# EAGLE design Interface (EAGLE 7.2.0)
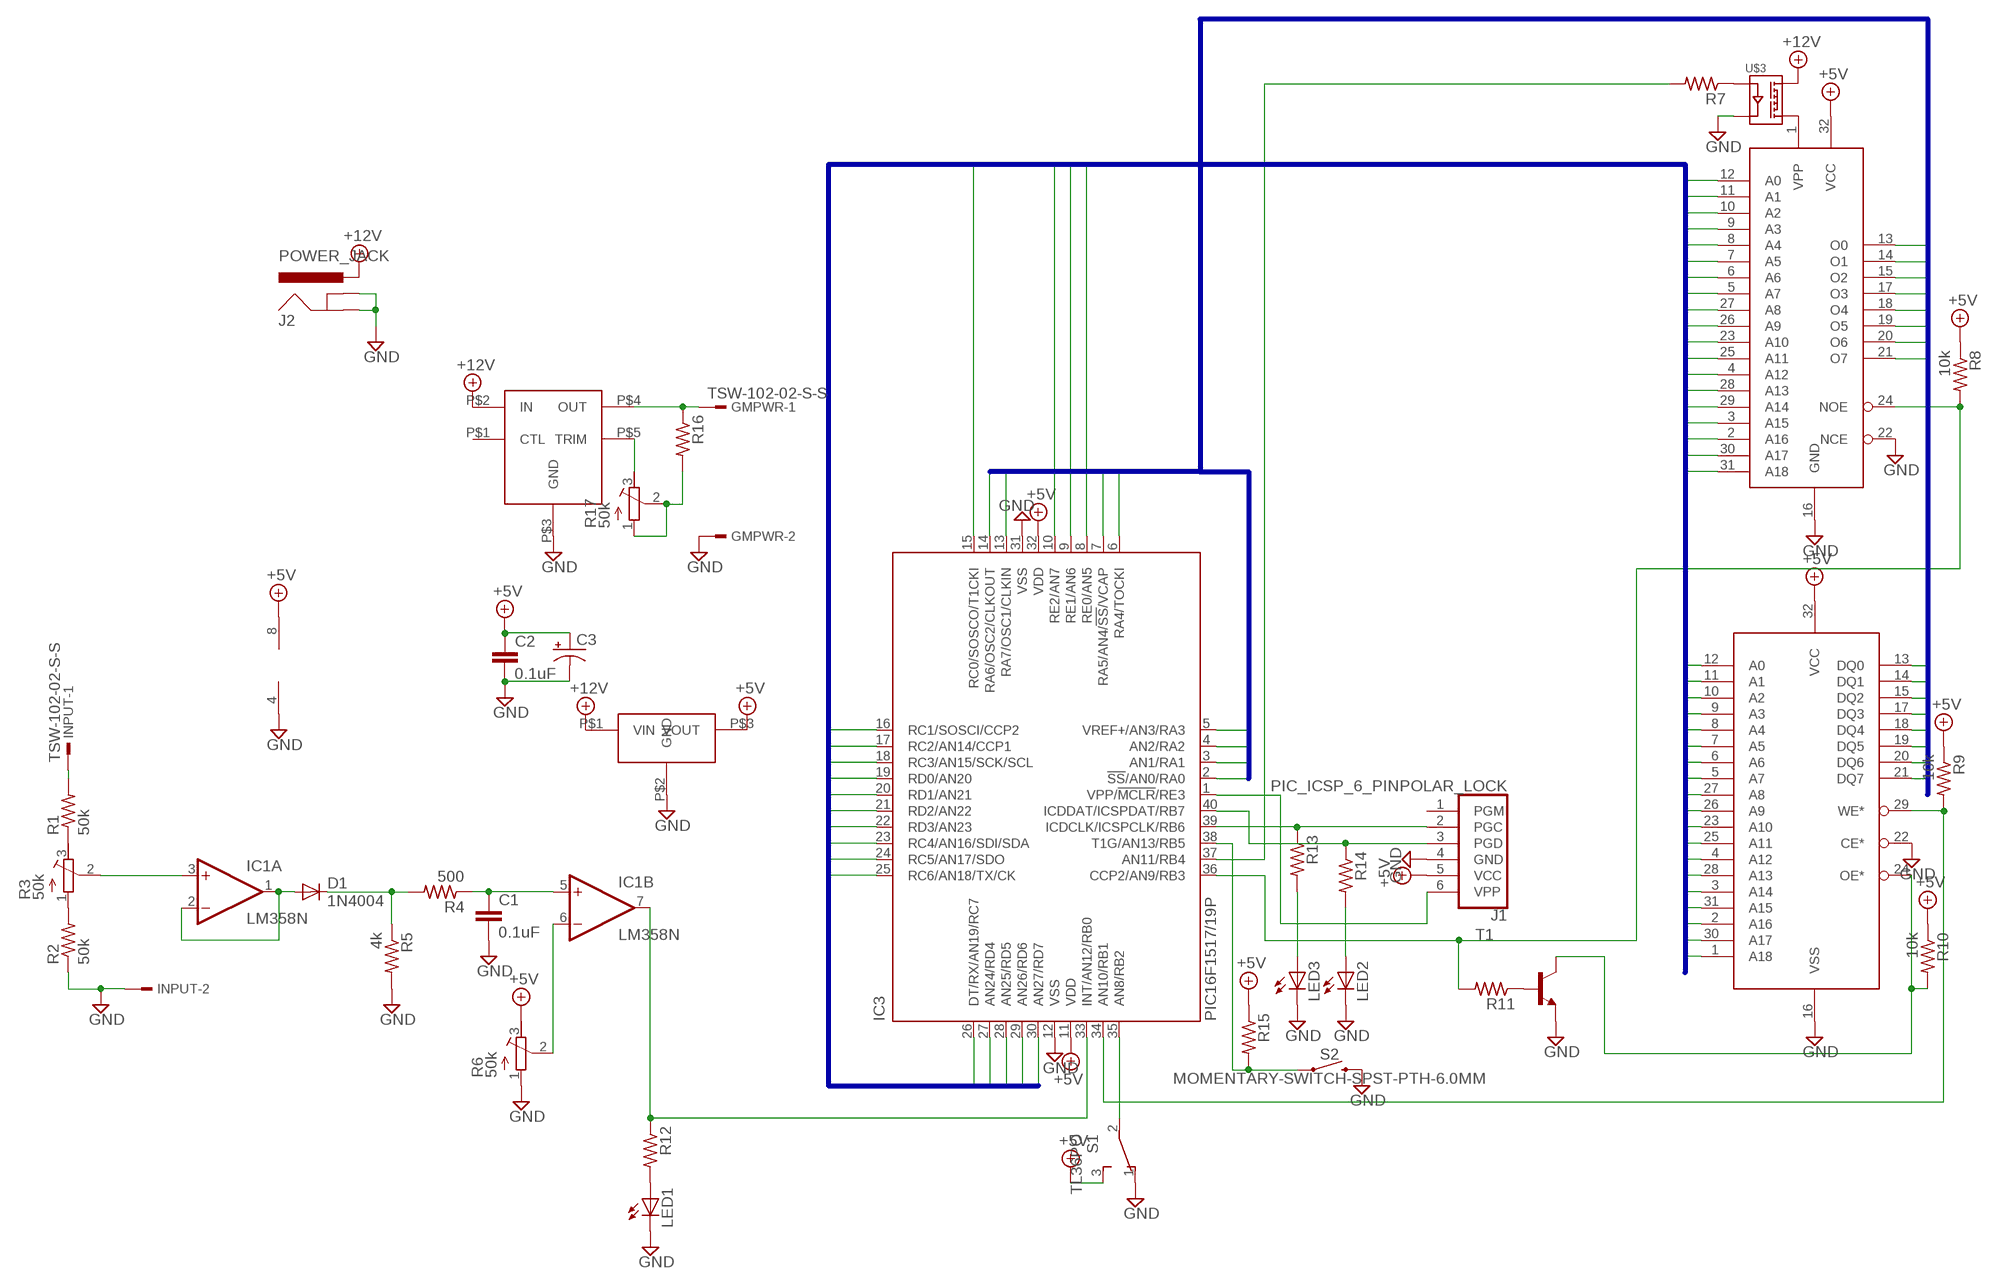
[diagram p0: schematic, sheet 1]

## Parts
C1  0.1uF  C-EU050-025X075  [C050-025X075]
C2  0.1uF  C-EU050-025X075  [C050-025X075]
C3  CPOL-USE5-8.5  [E5-8,5]
D1  1N4004  [DO41-10]
GMPWR  TSW-102-02-S-S  [TSW-102-02-S-S]
IC1  LM358N  [DIL08]
IC3  PIC16F1517/19P  [DIL40]
INPUT  TSW-102-02-S-S  [TSW-102-02-S-S]
J1  PIC_ICSP_6_PINPOLAR_LOCK  [MOLEX-1X6_LOCK]
J2  POWER_JACK  [POWER_JACK_PTH]
LED1  LED3MM  [LED3MM]
LED2  LED3MM  [LED3MM]
LED3  LED3MM  [LED3MM]
R1  50k  R-US_0204/2V  [0204V]
R2  50k  R-US_0204/2V  [0204V]
R3  50k  R-TRIMM3296W  [RTRIM3296W]
R4  500  R-US_0204/2V  [0204V]
R5  4k  R-US_0204/2V  [0204V]
R6  50k  R-TRIMM3296W  [RTRIM3296W]
R7  R-US_0204/2V  [0204V]
R8  10k  R-US_0204/2V  [0204V]
R9  10k  R-US_0204/2V  [0204V]
R10  10k  R-US_0204/2V  [0204V]
R11  R-US_0204/2V  [0204V]
R12  R-US_0204/2V  [0204V]
R13  R-US_0204/2V  [0204V]
R14  R-US_0204/2V  [0204V]
R15  R-US_0204/2V  [0204V]
R16  R-US_0204/2V  [0204V]
R17  50k  R-TRIMM3296W  [RTRIM3296W]
S1  TL36PO  [TL3XPO]
S2  MOMENTARY-SWITCH-SPST-PTH-6.0MM  [TACTILE_SWITCH_PTH_6.0MM]
T1  MPS2222A-NPN-TO92-CBE  [TO92-CBE]
U$1  AT27C040  [DIL32]
U$2  AS6C4008  [DIL32]
U$3  CPC1008N  [SOP04]
U$4  OKR-T/1.5-W12-C  OKR-T  [SIP5]
U$5  OKI-78SR-5/1.5-W36-C  [SIP_PS]

## Nets
+5V: C2.1 C3.+ IC1.8(P:V+) IC3.11(VDD) IC3.32(VDD) J1.5(VCC) R6.3(E) R8.1 R9.1 R10.1 R15.1 S1.3(S) U$1.32(VCC) U$2.32(VCC) U$5.P$3(VOUT)
+12V: J2.PWR U$3.4(DC) U$4.P$2(IN) U$5.P$1(VIN)
A0: IC3.15(RC0/SOSCO/T1CKI) U$1.12(A0) U$2.12(A0)
A1: IC3.16(RC1/SOSCI/CCP2) U$1.11(A1) U$2.11(A1)
A2: IC3.17(RC2/AN14/CCP1) U$1.10(A2) U$2.10(A2)
A3: IC3.18(RC3/AN15/SCK/SCL) U$1.9(A3) U$2.9(A3)
A4: IC3.23(RC4/AN16/SDI/SDA) U$1.8(A4) U$2.8(A4)
A5: IC3.24(RC5/AN17/SDO) U$1.7(A5) U$2.7(A5)
A6: IC3.25(RC6/AN18/TX/CK) U$1.6(A6) U$2.6(A6)
A7: IC3.26(DT/RX/AN19/RC7) U$1.5(A7) U$2.5(A7)
A8: IC3.19(RD0/AN20) U$1.27(A8) U$2.27(A8)
A9: IC3.20(RD1/AN21) U$1.26(A9) U$2.26(A9)
A10: IC3.21(RD2/AN22) U$1.23(A10) U$2.23(A10)
A11: IC3.22(RD3/AN23) U$1.25(A11) U$2.25(A11)
A12: IC3.27(AN24/RD4) U$1.4(A12) U$2.4(A12)
A13: IC3.28(AN25/RD5) U$1.28(A13) U$2.28(A13)
A14: IC3.29(AN26/RD6) U$1.29(A14) U$2.3(A14)
A15: IC3.30(AN27/RD7) U$1.3(A15) U$2.31(A15)
A16: IC3.8(RE0/AN5) U$1.2(A16) U$2.2(A16)
A17: IC3.9(RE1/AN6) U$1.30(A17) U$2.30(A17)
A18: IC3.10(RE2/AN7) U$1.31(A18) U$2.1(A18)
D0: IC3.2(!SS!/AN0/RA0) U$1.13(O0) U$2.13(DQ0)
D1: IC3.3(AN1/RA1) U$1.14(O1) U$2.14(DQ1)
D2: IC3.4(AN2/RA2) U$1.15(O2) U$2.15(DQ2)
D3: IC3.5(VREF+/AN3/RA3) U$1.17(O3) U$2.17(DQ3)
D4: IC3.6(RA4/TOCKI) U$1.18(O4) U$2.18(DQ4)
D5: IC3.7(RA5/AN4/!SS!/VCAP) U$1.19(O5) U$2.19(DQ5)
D6: IC3.14(RA6/OSC2/CLKOUT) U$1.20(O6) U$2.20(DQ6)
D7: IC3.13(RA7/OSC1/CLKIN) U$1.21(O7) U$2.21(DQ7)
GND: C1.2 C2.2 C3.- GMPWR.2 IC1.4(P:V-) IC3.12(VSS) IC3.31(VSS) INPUT.2 J1.4(GND) J2.GND J2.GNDBREAK LED1.K(C) LED2.K(C) LED3.K(C) R2.1 R5.2 R6.1(A) S1.1(O) S2.3 T1.E U$1.16(GND) U$1.22(NCE) U$2.16(VSS) U$2.22(CE*) U$3.3(IN-) U$4.P$3(GND) U$5.P$2(GND)
N$1: R1.1 R3.3(E)
N$2: R2.2 R3.1(A)
N$3: IC1.6(B:-IN) R6.2(S)
N$4: INPUT.1 R1.2
N$5: D1.A IC1.1(A:OUT) IC1.2(A:-IN)
N$6: IC1.3(A:+IN) R3.2(S)
N$7: D1.C R4.2 R5.1
N$8: C1.1 IC1.5(B:+IN) R4.1
N$9: IC3.39(ICDCLK/ICSPCLK/RB6) J1.2(PGC) R13.1
N$10: IC3.40(ICDDAT/ICSPDAT/RB7) J1.3(PGD) R14.1
N$11: IC3.34(AN10/RB1) R9.2 U$2.29(WE*)
N$12: R11.1 T1.B
N$13: IC3.36(CCP2/AN9/RB3) R8.2 R11.2 U$1.24(NOE)
N$14: IC1.7(B:OUT) IC3.33(INT/AN12/RB0) R12.1
N$15: IC3.1(VPP/!MCLR!/RE3) J1.6(VPP)
N$16: U$1.1(VPP) U$3.6(DC)
N$17: R7.1 U$3.1(IN+)
N$18: IC3.37(AN11/RB4) R7.2
N$19: R10.2 T1.C U$2.24(OE*)
N$20: LED1.A R12.2
N$21: IC3.35(AN8/RB2) S1.2(P)
N$22: LED2.A R14.2
N$23: LED3.A R13.2
N$24: IC3.38(T1G/AN13/RB5) R15.2 S2.1
N$25: GMPWR.1 R16.1 U$4.P$4(OUT)
N$26: R17.3(E) U$4.P$5(TRIM)
N$27: R16.2 R17.1(A) R17.2(S)
Unconnected: J1.1(PGM) U$4.P$1(CTL)

## Buses
A0,A1,A2,A3,A4,A5,A6,A7,A8,A9,A10,A11,A12,A13,A14,A15,A16,A17,A18
D0,D1,D2,D3,D4,D5,D6,D7

## Library data of the parts
C1 C2 = resistor:C-EU: CAPACITOR, European symbol
C3 = resistor:CPOL-US: POLARIZED CAPACITOR, American symbol
D1 = diode:1N4004: DIODE general purpose rectifier, 1 A
GMPWR INPUT = con-samtec:TSW-102-02-S-S: THROUGH-HOLE .025" SQ POST HEADER Source: Samtec TSW.pdf; OC_FARNELL: unknown; OC_NEWARK: unknown
IC1 = linear:LM358: OP AMP also LM158; LM258; LM2904 Source: http://cache.national.com/ds/LM/LM158.pdf
IC3 = microchip:PIC16*F1517/19: 28/40/44-Pin Flash Microcontrollers with nanoWatt XLP Technology PIC16F1517/1519 AND PIC16LF1517/1519 Source: www.microchip.com PIC16F1516.pdf
J1 = SparkFun-Connectors:PIC_ICSP_6_PIN: ISCP Programming connector for PICs This 6 pin header contains all the lines necessary for programming most PIC microcontrollers. Here is the connector we sell at SparkFun: Polarized Connectors - Header (6-Pin) <https://www.sparkfun.com/products/8094> (PRT-08094) It is used on this SparkFun product: SparkFun UDB5 - PIC UAV Development Board <https://www.sparkfun.com/products/11703> (DEV-11703) Also, if you need a nice PIC programmer, please check these out: MPLAB PICkit 3 <https://www.sparkfun.com/products/9973> (PGM-09973)
J2 = SparkFun-Connectors:POWER_JACK: Power Jack Connector This is the standard 5.5mm barrel jack for power. The PTH is the most common, proven, reliable, footprint. The Slot footprint only works if the mill layer is transmitted to the PCB fab house so be warned. Here are the connectors we sell at SparkFun: DC Barrel Power Jack/Connector <https://www.sparkfun.com/products/119> (PRT-00119) DC Barrel Power Jack/Connector (SMD) <https://www.sparkfun.com/products/12748> (PRT-12748) DC Barrel Jack Adapter - Breadboard Compatible <https://www.sparkfun.com/products/10811> (PRT-10811) It is used on this SparkFun product (and many, many others): SparkFun RedBoard - Programmed with Arduino <https://www.sparkfun.com/products/12757> (DEV-12757) Also, if you need a mating power supply or connector, please check these out: Wall Adapter Power Supply - 9VDC 650mA <https://www.sparkfun.com/products/298> (TOL-00298) DC Barrel Jack Adapter - Male <https://www.sparkfun.com/products/10287> (PRT-10287); PROD_ID: CONN-08197
LED1-LED3 = led:LED: LED OSRAM: - CHIPLED LG R971, LG N971, LY N971, LG Q971, LY Q971, LO R971, LY R971 LH N974, LH R974 LS Q976, LO Q976, LY Q976 LO Q996 - Hyper CHIPLED LW Q18S LB Q993, LB Q99A, LB R99A - SideLED LS A670, LO A670, LY A670, LG A670, LP A670 LB A673, LV A673, LT A673, LW A673 LH A674 LY A675 LS A676, LA A676, LO A676, LY A676, LW A676 LS A679, LY A679, LG A679 - Hyper Micro SIDELED® LS Y876, LA Y876, LO Y876, LY Y876 LT Y87S - SmartLED LW L88C, LW L88S LB L89C, LB L89S, LG L890 LS L89K, LO L89K, LY L89K LS L896, LA L896, LO L896, LY L896 - TOPLED LS T670, LO T670, LY T670, LG T670, LP T670 LSG T670, LSP T670, LSY T670, LOP T670, LYG T670 LG T671, LOG T671, LSG T671 LB T673, LV T673, LT T673, LW T673 LH T674 LS T676, LA T676, LO T676, LY T676, LB T676, LH T676, LSB T676, LW T676 LB T67C, LV T67C, LT T67C, LS T67K, LO T67K, LY T67K, LW E67C LS E67B, LA E67B, LO E67B, LY E67B, LB E67C, LV E67C, LT E67C LW T67C LS T679, LY T679, LG T679 LS T770, LO T770, LY T770, LG T770, LP T770 LB T773, LV T773, LT T773, LW T773 LH T774 LS E675, LA E675, LY E675, LS T675 LS T776, LA T776, LO T776, LY T776, LB T776 LHGB T686 LT T68C, LB T68C - Hyper Mini TOPLED® LB M676 - Mini TOPLED Santana® LG M470 LS M47K, LO M47K, LY M47K Source: http://www.osram.convergy.de LUXEON: - LUMILED® LXK2-PW12-R00, LXK2-PW12-S00, LXK2-PW14-U00, LXK2-PW14-V00 LXK2-PM12-R00, LXK2-PM12-S00, LXK2-PM14-U00 LXK2-PE12-Q00, LXK2-PE12-R00, LXK2-PE12-S00, LXK2-PE14-T00, LXK2-PE14-U00 LXK2-PB12-K00, LXK2-PB12-L00, LXK2-PB12-M00, LXK2-PB14-N00, LXK2-PB14-P00, LXK2-PB14-Q00 LXK2-PR12-L00, LXK2-PR12-M00, LXK2-PR14-Q00, LXK2-PR14-R00 LXK2-PD12-Q00, LXK2-PD12-R00, LXK2-PD12-S00 LXK2-PH12-R00, LXK2-PH12-S00 LXK2-PL12-P00, LXK2-PL12-Q00, LXK2-PL12-R00 Source: www.luxeon.com KINGBRIGHT: KA-3528ASYC Source: www.kingbright.com
R1 R2 R4 R5 R7-R16 = resistor:R-US_: RESISTOR, American symbol
R3 R6 R17 = resistor:R-TRIMM: Trimm resistor
S1 = switch:TL36PO: TINY SWITCH ON - ON Source: http://www2.produktinfo.conrad.com/datenblaetter/700000-724999/705152-da-01-de-Subminiaturschalter_TL_36YO.pdf
S2 = SparkFun-Switches:MOMENTARY-SWITCH-SPST: Momentary Switch (Pushbutton) - SPST Normally-open (NO) SPST momentary switches (buttons, pushbuttons). Variants PTH-12MM - 12mm square, through-hole Momentary Pushbutton Switch - 12mm Square <https://www.sparkfun.com/products/9190> (COM-09190) PTH-6.0MM, PTH-6.0MM-KIT - 6.0mm square, through-hole Mini Pushbutton Switch <https://www.sparkfun.com/products/97> (COM-00097) KIT package intended for soldering kit's - only one side of pads' copper is exposed. PTH-RIGHT-ANGLE-KIT - Right-angle, through-hole Right Angle Tactile Button <https://www.sparkfun.com/products/10791> - Used on SparkFun BigTime Watch Kit <https://www.sparkfun.com/products/11734> SMD-12MM - 12mm square, surface-mount Tactile Button - SMD (12mm) <https://www.sparkfun.com/products/12993> (COM-12993) Used on SparkFun PicoBoard <https://www.sparkfun.com/products/11888> SMD-4.5MM - 4.5mm Square Trackball Switch Used on SparkFun Blackberry Trackballer Breakout <https://www.sparkfun.com/products/13169> SMD-4.6MMX2.8MM - 4.60mm x 2.80mm, surface mount Used on SparkFun SAMD21 Mini Breakout <https://www.sparkfun.com/products/13664> SMD-5.2MM, SMD-5.2-REDUNDANT - 5.2mm square, surface-mount Mini Pushbutton Switch - SMD <https://www.sparkfun.com/products/8720> (COM-08720) Used on Arduino Pro Mini <https://www.sparkfun.com/products/11114> REDUNDANT package connects both switch circuits together SMD-6.0X3.5MM - 6.0 x 3.5mm, surface mount Momentary Reset Switch SMD <https://www.sparkfun.com/products/8229> (COM-08229) SMD-6.2MM-TALL - 6.2mm square, surface mount Tactile Button - SMD (6mm) <https://www.sparkfun.com/products/12992> Used on SparkFun Digital Sandbox <https://www.sparkfun.com/products/12651> SMD-RIGHT-ANGLE - Right-angle, surface mount Used on SparkFun Block for Intel® Edison - Arduino <https://www.sparkfun.com/products/13036>; PROD_ID: SWCH-08441; SF_SKU: COM-00097
T1 = transistor:*-NPN-: NPN Transistror BF959 corrected 2008.03.06
U$1 = Football:AT27C040
U$2 = Football:AS6C4008
U$3 = JSB2:CPC1008N
U$4 = Football:OKR-T
U$5 = JSB2:OKI-78SR-5/1.5-W36-C

## Board
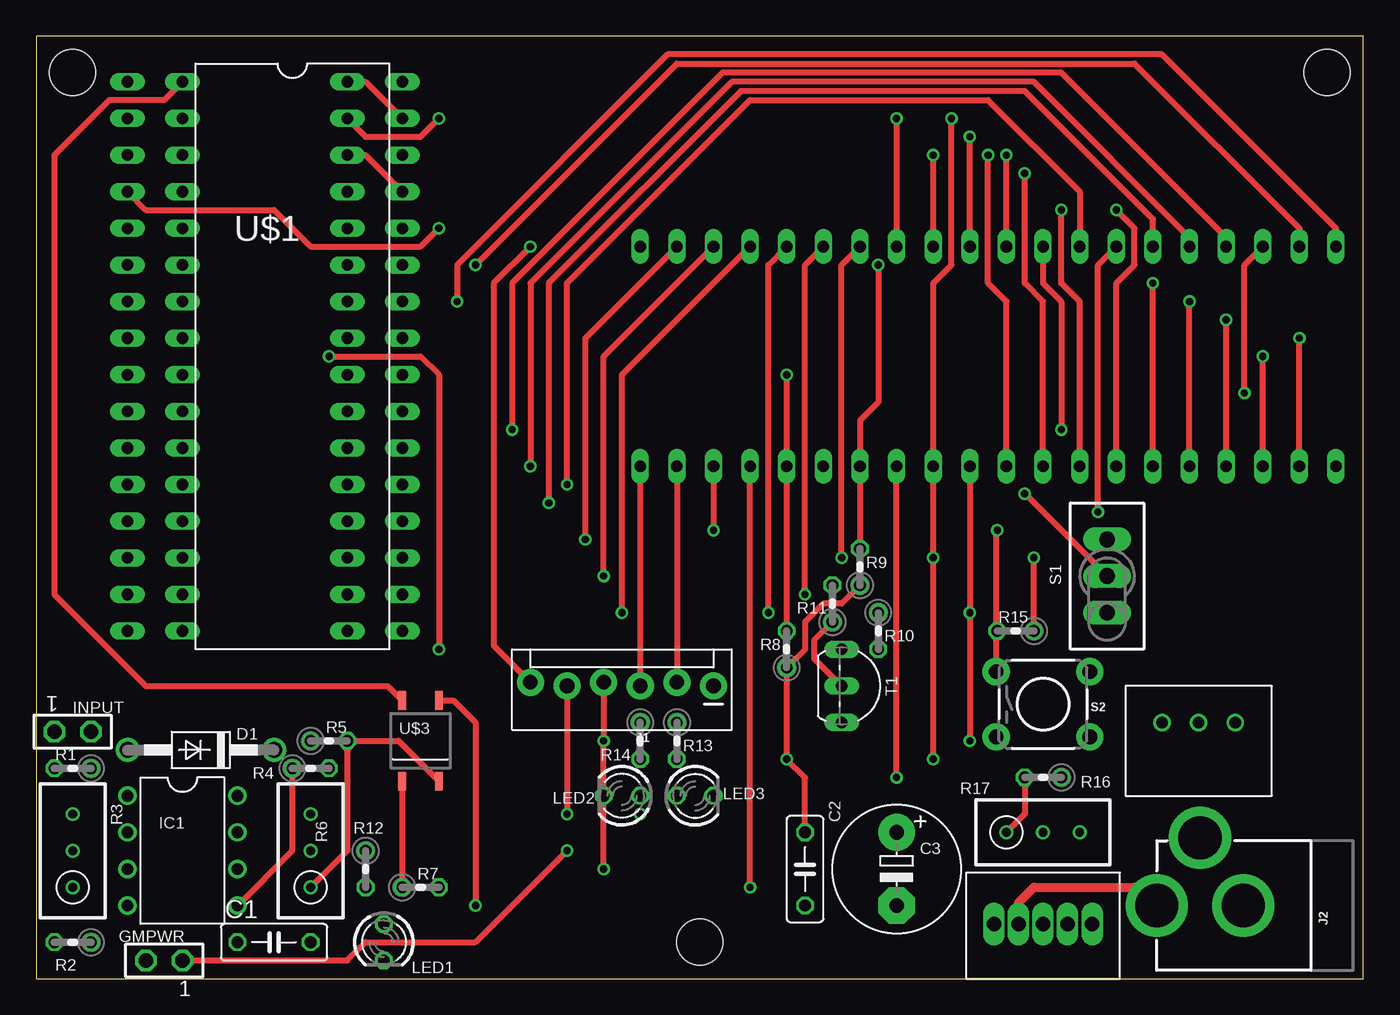
[diagram p1: board, top side]
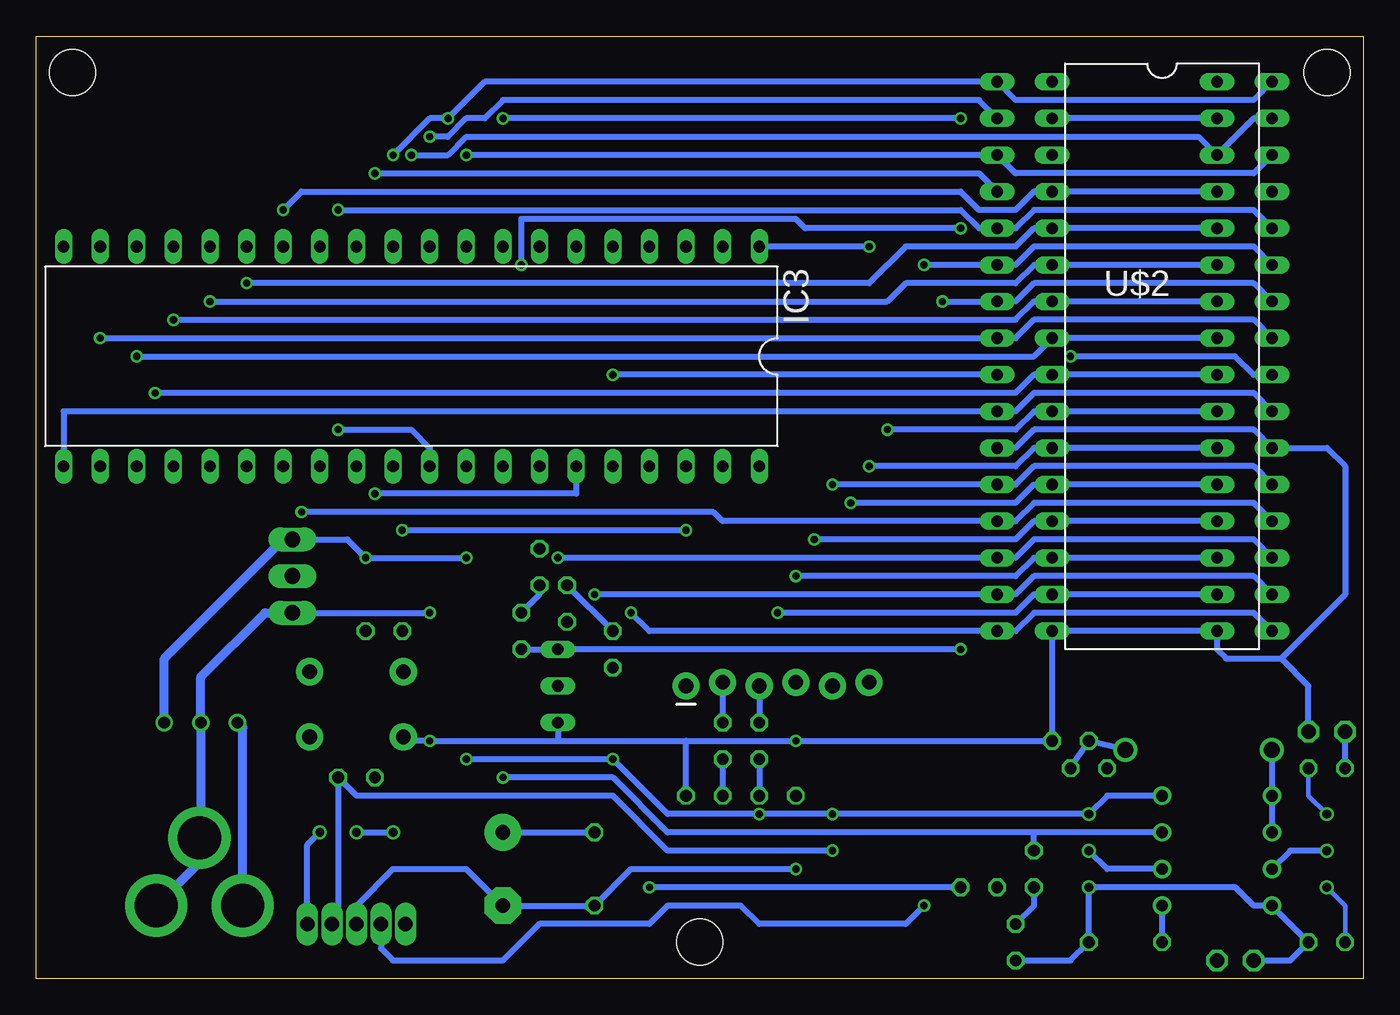
[diagram p2: board, bottom side, seen from below]

Size 92.08 x 65.41 mm. Coordinates in mm from the lower left corner, seen from the top.
Outline: 0,0 92.08,0 92.08,65.41 0,65.41 0,0
Copper layers (1*16): Top 0.0356mm / dielectric 1.5011mm / Bottom 0.0356mm
Design rules "Oshpark": minimum track width 6mil, minimum drill 13mil, track to track 6mil, track to pad 6mil, pad to pad 6mil, via to via 6mil, smd to smd 6mil, copper to edge 15mil, drill to drill 6mil, minimum pad ring 7mil, minimum via ring 7mil, stop-mask expansion 3mil, vias tented up to drill 0mil, thermal gap 10mil
Holes 3.2 mm at 46.04,2.54 89.53,62.87 2.54,62.87

### Footprints (pad centres in the part's own frame; a part is rotated, then mirrored left to right if it is on the bottom)
C050-025X075 = drill 0.813 octagon: 1 -2.54,0; 2 2.54,0
E5-8,5 = drill 1.016 pad 2.54: + -2.54,0 | drill 1.016 pad 2.54 octagon: - 2.54,0
DO41-10 = drill 1.118: A 5.08,0; C -5.08,0
TSW-102-02-S-S = drill 1 pad 1.5 octagon: 1 1.27,0; 2 -1.27,0
DIL08 = drill 0.813 pad 1.27: 1 -3.81,-3.81; 2 -1.27,-3.81; 3 1.27,-3.81; 4 3.81,-3.81; 5 3.81,3.81; 6 1.27,3.81; 7 -1.27,3.81; 8 -3.81,3.81
DIL40 = drill 0.813 long: 1 -24.13,-7.62; 2 -21.59,-7.62; 3 -19.05,-7.62; 4 -16.51,-7.62; 5 -13.97,-7.62; 6 -11.43,-7.62; 7 -8.89,-7.62; 8 -6.35,-7.62; 9 -3.81,-7.62; 10 -1.27,-7.62; 11 1.27,-7.62; 12 3.81,-7.62; 13 6.35,-7.62; 14 8.89,-7.62; 15 11.43,-7.62; 16 13.97,-7.62; 17 16.51,-7.62; 18 19.05,-7.62; 19 21.59,-7.62; 20 24.13,-7.62; 21 24.13,7.62; 22 21.59,7.62; 23 19.05,7.62; 24 16.51,7.62; 25 13.97,7.62; 26 11.43,7.62; 27 8.89,7.62; 28 6.35,7.62; 29 3.81,7.62; 30 1.27,7.62; 31 -1.27,7.62; 32 -3.81,7.62; 33 -6.35,7.62; 34 -8.89,7.62; 35 -11.43,7.62; 36 -13.97,7.62; 37 -16.51,7.62; 38 -19.05,7.62; 39 -21.59,7.62; 40 -24.13,7.62
MOLEX-1X6_LOCK = drill 1.016 pad 1.88: 1 0,0; 2 2.54,-0.254; 3 5.08,0; 4 7.62,-0.254; 5 10.16,0; 6 12.7,-0.254
POWER_JACK_PTH = drill 2.997 pad 4.318: GND 0,7.7; GNDBREAK 4.7,10.7; PWR 0,13.7
LED3MM = drill 0.813 octagon: A -1.27,0; K 1.27,0
0204V = drill 0.813 octagon: 1 -1.27,0; 2 1.27,0
RTRIM3296W = drill 0.61: 1 0,-2.54; 2 0,0; 3 0,2.54
TL3XPO = drill 1.1 pad 1.422 long: 1 -2.54,0; 2 0,0; 3 2.54,0
TACTILE_SWITCH_PTH_6.0MM = drill 1.016 pad 1.88: 1 -3.251,2.261; 2 3.251,2.261; 3 -3.251,-2.261; 4 3.251,-2.261
TO92-CBE = drill 0.813 long: B 0,0; C -2.54,0; E 2.54,0
DIL32 = drill 0.813 long: 1 -19.05,-7.62; 2 -16.51,-7.62; 3 -13.97,-7.62; 4 -11.43,-7.62; 5 -8.89,-7.62; 6 -6.35,-7.62; 7 -3.81,-7.62; 8 -1.27,-7.62; 9 1.27,-7.62; 10 3.81,-7.62; 11 6.35,-7.62; 12 8.89,-7.62; 13 11.43,-7.62; 14 13.97,-7.62; 15 16.51,-7.62; 16 19.05,-7.62; 17 19.05,7.62; 18 16.51,7.62; 19 13.97,7.62; 20 11.43,7.62; 21 8.89,7.62; 22 6.35,7.62; 23 3.81,7.62; 24 1.27,7.62; 25 -1.27,7.62; 26 -3.81,7.62; 27 -6.35,7.62; 28 -8.89,7.62; 29 -11.43,7.62; 30 -13.97,7.62; 31 -16.51,7.62; 32 -19.05,7.62
SOP04 = smd 0.551 x 1.3: 1 -1.27,-2.8; 3 1.27,-2.8; 4 1.27,2.8; 6 -1.27,2.8
SIP5 = drill 1 long: P$1 -3.404,0; P$2 -1.702,0; P$3 0,0; P$4 1.702,0; P$5 3.404,0
SIP_PS = drill 0.8: P$1 -2.54,0; P$2 0,0; P$3 2.54,0

### Placement (x,y rotation side)
C1  16.51,2.54 0 top
C2  53.34,7.62 270 top
C3  59.69,7.62 270 top
D1  11.43,15.88 180 top
GMPWR  8.89,1.27 0 top
IC1  10.16,8.89 270 top
IC3  66.04,43.18 180 bottom
INPUT  2.54,17.14 180 top
J1  46.99,20.32 180 top
J2  91.44,5.08 90 top
LED1  24.13,2.54 270 top
LED2  40.64,12.7 180 top
LED3  45.72,12.7 0 top
R1  2.54,14.61 180 top
R2  2.54,2.54 180 top
R3  2.54,8.89 0 top
R4  19.05,14.61 0 top
R5  20.32,16.51 0 top
R6  19.05,8.89 0 top
R7  26.67,6.35 0 top
R8  52.07,22.86 90 top
R9  57.15,28.57 90 top
R10  58.42,24.13 270 top
R11  55.24,26.04 90 top
R12  22.86,7.62 270 top
R13  44.45,16.51 270 top
R14  41.91,16.51 270 top
R15  67.94,24.13 180 top
R16  69.85,13.97 180 top
R17  69.85,10.16 270 top
S1  74.3,27.94 90 top
S2  69.85,19.05 0 top
T1  55.88,20.32 270 top
U$1  17.78,43.18 270 top
U$2  13.97,43.18 270 bottom
U$3  26.67,16.51 0 top
U$4  69.85,3.81 0 top
U$5  80.64,17.78 0 top

### Tracks (layer width: path | path; a pad name or v marks a point on that pad's centre or on a via)
+5V  (via drill 0.5)
  Top 0.406: IC3.11 v67.31,57.15 | v62.23,15.24 v62.23,29.21 IC3.32 62.23,48.26 63.5,49.53 v63.5,59.69 | C2.1 53.34,13.97 v52.07,15.24 R8.1 53.34,22.86 53.34,24.77 54.61,26.04 55.88,26.04 R9.1 | J1.5 v36.83,11.43 | R15.1 v69.22,29.21
  Bottom 0.406: IC1.8 17.78,12.7 R6.3 v36.83,11.43 v41.91,11.43 48.26,11.43 v52.07,15.24 v62.23,15.24 | v67.31,57.15 64.77,59.69 v63.5,59.69 60.96,62.23 U$1.32 24.13,60.96 7.62,60.96 U$2.32 | C3.+ C2.1 | R9.1 57.15,26.67 R10.1 | S1.3 70.48,30.48 v69.22,29.21 v62.23,29.21
  Bottom 0.61: S1.3 74.93,30.48 83.19,22.23 U$5.P$3
+12V  (via drill 0.5)
  Top 0.406: U$3.4 28.95,19.31 30.48,17.78 v30.48,5.08
  Top 0.61: J2.PWR 77.47,5.08 76.2,6.35 69.22,6.35 68.15,5.28 U$4.P$2
  Bottom 0.406: v30.48,5.08 31.75,3.81 41.91,3.81 43.18,5.08 48.26,5.08 49.53,3.81 57.15,3.81 59.69,1.27 67.31,1.27 68.15,2.11 U$4.P$2
  Bottom 0.61: J2.PWR 77.74,17.41 U$5.P$1
A0  (via drill 0.5)
  Top 0.406: IC3.15 77.47,52.7 68.58,61.59 48.9,61.59 35.56,48.26 v35.56,33.02
  Bottom 0.406: U$1.12 U$2.12 22.86,34.29 24.13,33.02 v35.56,33.02
A1  (via drill 0.5)
  Top 0.406: IC3.16 80.01,51.44 69.22,62.23 48.26,62.23 34.29,48.26 v34.29,35.56
  Bottom 0.406: U$1.11 U$2.11 22.86,36.83 24.13,35.56 v34.29,35.56
A2  (via drill 0.5)
  Top 0.406: IC3.17 82.55,51.44 71.12,62.87 47.62,62.87 33.02,48.26 v33.02,38.1
  Bottom 0.406: U$1.10 U$2.10 22.86,39.37 24.13,38.1 v33.02,38.1
A3  (via drill 0.5)
  Top 0.406: v83.82,40.64 83.82,49.53 IC3.18
  Bottom 0.406: U$1.9 U$2.9 22.86,41.91 24.13,40.64 v83.82,40.64
A4  (via drill 0.5)
  Top 0.406: IC3.23 v85.09,43.18
  Bottom 0.406: U$1.8 U$2.8 22.86,43.18 v85.09,43.18
A5  (via drill 0.5)
  Top 0.406: IC3.24 v82.55,45.72
  Bottom 0.406: U$1.7 U$2.7 22.86,46.99 24.13,45.72 v82.55,45.72
A6  (via drill 0.5)
  Top 0.406: IC3.25 v80.01,46.99
  Bottom 0.406: U$1.6 U$2.6 22.86,49.53 24.13,48.26 31.75,48.26 33.02,46.99 v80.01,46.99
A7  (via drill 0.5)
  Top 0.406: IC3.26 v77.47,48.26
  Bottom 0.406: U$1.5 U$2.5 22.86,52.07 24.13,50.8 31.75,50.8 34.29,48.26 v77.47,48.26
A8  (via drill 0.5)
  Top 0.406: v30.48,49.53 44.45,63.5 76.2,63.5 87.63,52.07 IC3.19
  Bottom 0.406: U$2.27 7.62,50.8 22.86,50.8 24.13,49.53 U$1.27 v30.48,49.53
A9  (via drill 0.5)
  Top 0.406: IC3.20 90.17,52.07 78.11,64.14 43.81,64.14 29.21,49.53 v29.21,46.99
  Bottom 0.406: U$2.26 7.62,48.26 22.86,48.26 24.13,46.99 U$1.26 v29.21,46.99
A10
  Bottom 0.406: U$2.23 7.62,40.64 22.86,40.64 24.13,39.37 U$1.23 90.17,39.37 IC3.21
A11  (via drill 0.5)
  Top 0.406: IC3.22 v87.63,44.45
  Bottom 0.406: U$2.25 7.62,45.72 22.86,45.72 24.13,44.45 U$1.25 v87.63,44.45
A12  (via drill 0.5)
  Top 0.406: IC3.27 74.93,48.26 76.2,49.53 76.2,52.07 v74.93,53.34
  Bottom 0.406: U$1.4 U$2.4 22.86,54.61 24.13,53.34 26.67,53.34 27.94,54.61 73.66,54.61 v74.93,53.34
A13  (via drill 0.5)
  Top 0.406: IC3.28 72.39,46.99 71.12,48.26 v71.12,53.34
  Bottom 0.406: U$2.28 7.62,53.34 22.86,53.34 24.13,52.07 U$1.28 26.67,52.07 27.94,53.34 v71.12,53.34
A14  (via drill 0.5)
  Top 0.406: IC3.29 69.85,46.99 68.58,48.26 v68.58,55.88 | U$2.3 22.86,57.15 U$1.29
  Bottom 0.406: v68.58,55.88 26.67,55.88 U$1.29
A15  (via drill 0.5)
  Top 0.406: IC3.30 67.31,46.99 66.04,48.26 v66.04,57.15
  Bottom 0.406: U$2.31 7.62,59.69 U$1.3 11.43,58.42 62.23,58.42 63.5,57.15 v66.04,57.15
A16  (via drill 0.5)
  Top 0.406: U$2.2 22.86,58.42 26.67,58.42 v27.94,59.69 | v59.69,59.69 IC3.8
  Bottom 0.406: U$1.2 U$2.2 | v27.94,59.69 v59.69,59.69
A17  (via drill 0.5)
  Top 0.406: IC3.9 v62.23,57.15
  Bottom 0.406: U$2.30 7.62,55.88 24.13,55.88 U$1.30 v62.23,57.15
A18  (via drill 0.5)
  Top 0.406: IC3.10 v64.77,58.42 | U$2.1 22.86,62.23 U$1.31
  Bottom 0.406: U$1.31 26.67,60.96 59.69,60.96 60.96,59.69 62.23,59.69 63.5,58.42 v64.77,58.42
D0  (via drill 0.5)
  Top 0.406: v38.1,30.48 38.1,44.45 IC3.2
  Bottom 0.406: U$1.13 U$2.13 22.86,31.75 24.13,30.48 v38.1,30.48
D1  (via drill 0.5)
  Top 0.406: v39.37,27.94 39.37,43.18 IC3.3
  Bottom 0.406: U$1.14 U$2.14 22.86,29.21 24.13,27.94 v39.37,27.94
D2  (via drill 0.5)
  Top 0.406: v40.64,25.4 40.64,41.91 IC3.4
  Bottom 0.406: U$1.15 U$2.15 22.86,26.67 24.13,25.4 v40.64,25.4
D3  (via drill 0.5)
  Top 0.406: v50.8,25.4 50.8,49.53 IC3.5
  Bottom 0.406: U$2.17 7.62,25.4 22.86,25.4 24.13,24.13 U$1.17 49.53,24.13 v50.8,25.4
D4  (via drill 0.5)
  Top 0.406: v53.34,26.67 53.34,49.53 IC3.6
  Bottom 0.406: U$2.18 7.62,27.94 22.86,27.94 24.13,26.67 U$1.18 v53.34,26.67
D5  (via drill 0.5)
  Top 0.406: v55.88,29.21 55.88,49.53 IC3.7
  Bottom 0.406: U$2.19 7.62,30.48 22.86,30.48 24.13,29.21 U$1.19 v55.88,29.21
D6  (via drill 0.5)
  Top 0.406: v73.66,32.38 73.66,49.53 IC3.14
  Bottom 0.406: U$2.20 7.62,33.02 22.86,33.02 24.13,31.75 U$1.20 44.45,31.75 45.09,32.38 v73.66,32.38
D7  (via drill 0.5)
  Top 0.406: v36.83,34.29 36.83,48.26 49.53,60.96 66.04,60.96 72.39,54.61 IC3.13
  Bottom 0.406: U$2.21 7.62,35.56 22.86,35.56 24.13,34.29 U$1.21 v36.83,34.29
GND  (via drill 0.5)
  Top 0.406: v39.37,7.62 LED2.K v39.37,16.51 J1.4 | U$3.3 25.14,16.51 R5.2 21.59,8.89 R6.1 | IC3.31 v64.77,25.4 v64.77,16.51 | IC3.12 69.85,48.26 71.12,46.99 v71.12,38.1
  Bottom 0.406: U$1.22 24.13,36.83 22.86,38.1 7.62,38.1 U$2.22 2.54,36.83 1.27,35.56 1.27,26.67 5.71,22.23 | v39.37,7.62 50.8,7.62 C2.2 C3.- 62.23,7.62 67.31,7.62 69.85,5.08 U$4.P$3 | 55.88,16.51 v64.77,16.51 66.32,16.51 S2.3 | 55.88,16.51 46.99,16.51 | 46.99,16.51 v39.37,16.51 R5.2 U$2.16 U$1.16 10.16,22.86 9.53,22.23 5.71,22.23 | T1.E 55.88,16.51 | LED1.K 20.32,1.27 C1.2 R6.1 8.89,6.35 7.62,5.08 IC1.4 R2.1 5.08,1.27 GMPWR.2 | S1.1 v64.77,25.4 | LED3.K 46.99,16.51 | INPUT.2 3.81,20.32 5.71,22.23 | v71.12,38.1 66.04,38.1 64.77,36.83 IC3.31
  Bottom 0.61: J2.GND 80.74,8.08 J2.GNDBREAK 80.64,9.88 U$5.P$2 80.64,20.95 76.2,25.4 S1.1
N$1
  Bottom 0.305: R1.1 3.81,12.7 R3.3
N$2
  Bottom 0.305: R2.2 1.27,5.08 R3.1
N$3
  Bottom 0.406: IC1.6 17.78,7.62 R6.2
N$4
  Bottom 0.406: R1.2 INPUT.1
N$5
  Bottom 0.406: IC1.2 IC1.1 D1.A
N$6
  Bottom 0.406: R3.2 5.08,8.89 IC1.3
N$7
  Bottom 0.406: D1.C R5.1 R4.2
N$8
  Top 0.406: R4.1 17.78,8.89 IC1.5
  Bottom 0.406: IC1.5 C1.1
N$9
  Top 0.406: IC3.39 J1.2
  Bottom 0.406: J1.2 R13.1
N$10
  Top 0.406: IC3.40 J1.3
  Bottom 0.406: J1.3 R14.1
N$11  (via drill 0.5)
  Top 0.406: U$2.29 7.62,53.34 16.51,53.34 19.05,50.8 26.67,50.8 v27.94,52.07 | v58.42,49.53 58.42,40.01 57.15,38.73 IC3.34 R9.2
  Bottom 0.406: v27.94,52.07 38.73,52.07 39.37,52.7 58.42,52.7 v58.42,49.53
N$12
  Top 0.406: R11.1 53.98,23.5 53.98,22.23 T1.B
N$13  (via drill 0.5)
  Top 0.406: v52.07,41.91 IC3.36 R8.2
  Bottom 0.406: U$1.24 v52.07,41.91 | R11.2 R8.2
N$14  (via drill 0.5)
  Top 0.406: v59.69,13.97 IC3.33
  Bottom 0.406: IC1.7 22.86,10.16 | 22.86,10.16 48.26,10.16 52.07,13.97 v59.69,13.97 | R12.1 22.86,10.16
N$15  (via drill 0.5)
  Top 0.406: v34.29,50.8 31.75,48.26 31.75,23.11 J1.6
  Bottom 0.406: v34.29,50.8 IC3.1
N$16
  Top 0.406: U$1.1 8.89,60.96 5.08,60.96 1.27,57.15 1.27,26.67 7.62,20.32 24.39,20.32 U$3.6
N$17
  Top 0.406: U$3.1 R7.1
N$18  (via drill 0.5)
  Top 0.406: v49.53,6.35 IC3.37
  Bottom 0.406: R7.2 v49.53,6.35
N$19  (via drill 0.5)
  Top 0.406: v20.32,43.18 26.67,43.18 27.94,41.91 v27.94,22.86
  Bottom 0.406: U$2.24 7.62,41.91 8.89,43.18 v20.32,43.18 | v27.94,22.86 T1.C R10.2
N$20
  Bottom 0.406: R12.2 22.86,5.08 LED1.A
N$21  (via drill 0.5)
  Top 0.406: S1.2 v68.58,33.66
  Bottom 0.406: IC3.35 54.61,33.66 v68.58,33.66
N$22
  Bottom 0.406: R14.2 LED2.A
N$23
  Bottom 0.406: R13.2 LED3.A
N$24  (via drill 0.5)
  Top 0.406: IC3.38 v46.99,31.11 | S2.1 66.6,24.13 | 66.6,24.13 66.6,31.04 v66.67,31.11 | R15.2 66.6,24.13
  Bottom 0.406: v46.99,31.11 v66.67,31.11
N$25  (via drill 0.5)
  Top 0.406: GMPWR.1 21.59,1.27 22.86,2.54 30.48,2.54 v36.83,8.89
  Bottom 0.406: v36.83,8.89 48.26,8.89 52.07,12.7 69.85,12.7 R16.1 71.12,4.24 U$4.P$4
N$26
  Bottom 0.406: U$4.P$5 73.25,9.3 R17.3
N$27
  Top 0.406: R16.2 68.58,11.43 R17.1
  Bottom 0.406: R17.2 R17.1